# Altium schematic sheet 80PIN_FMU_REV_2A.SchDoc: Cube Yellow and Cube Orange
size A3; Date: 18/08/2014 1:53:28 PM; Author: PR; DrawnBy: Philip Rowse; Engineer: Philip Rowse; Organization: ProfiCNC/Hex; Address3: VIC; Address4: Australia; Revision: A; SheetNumber: 1; SheetTotal: 10
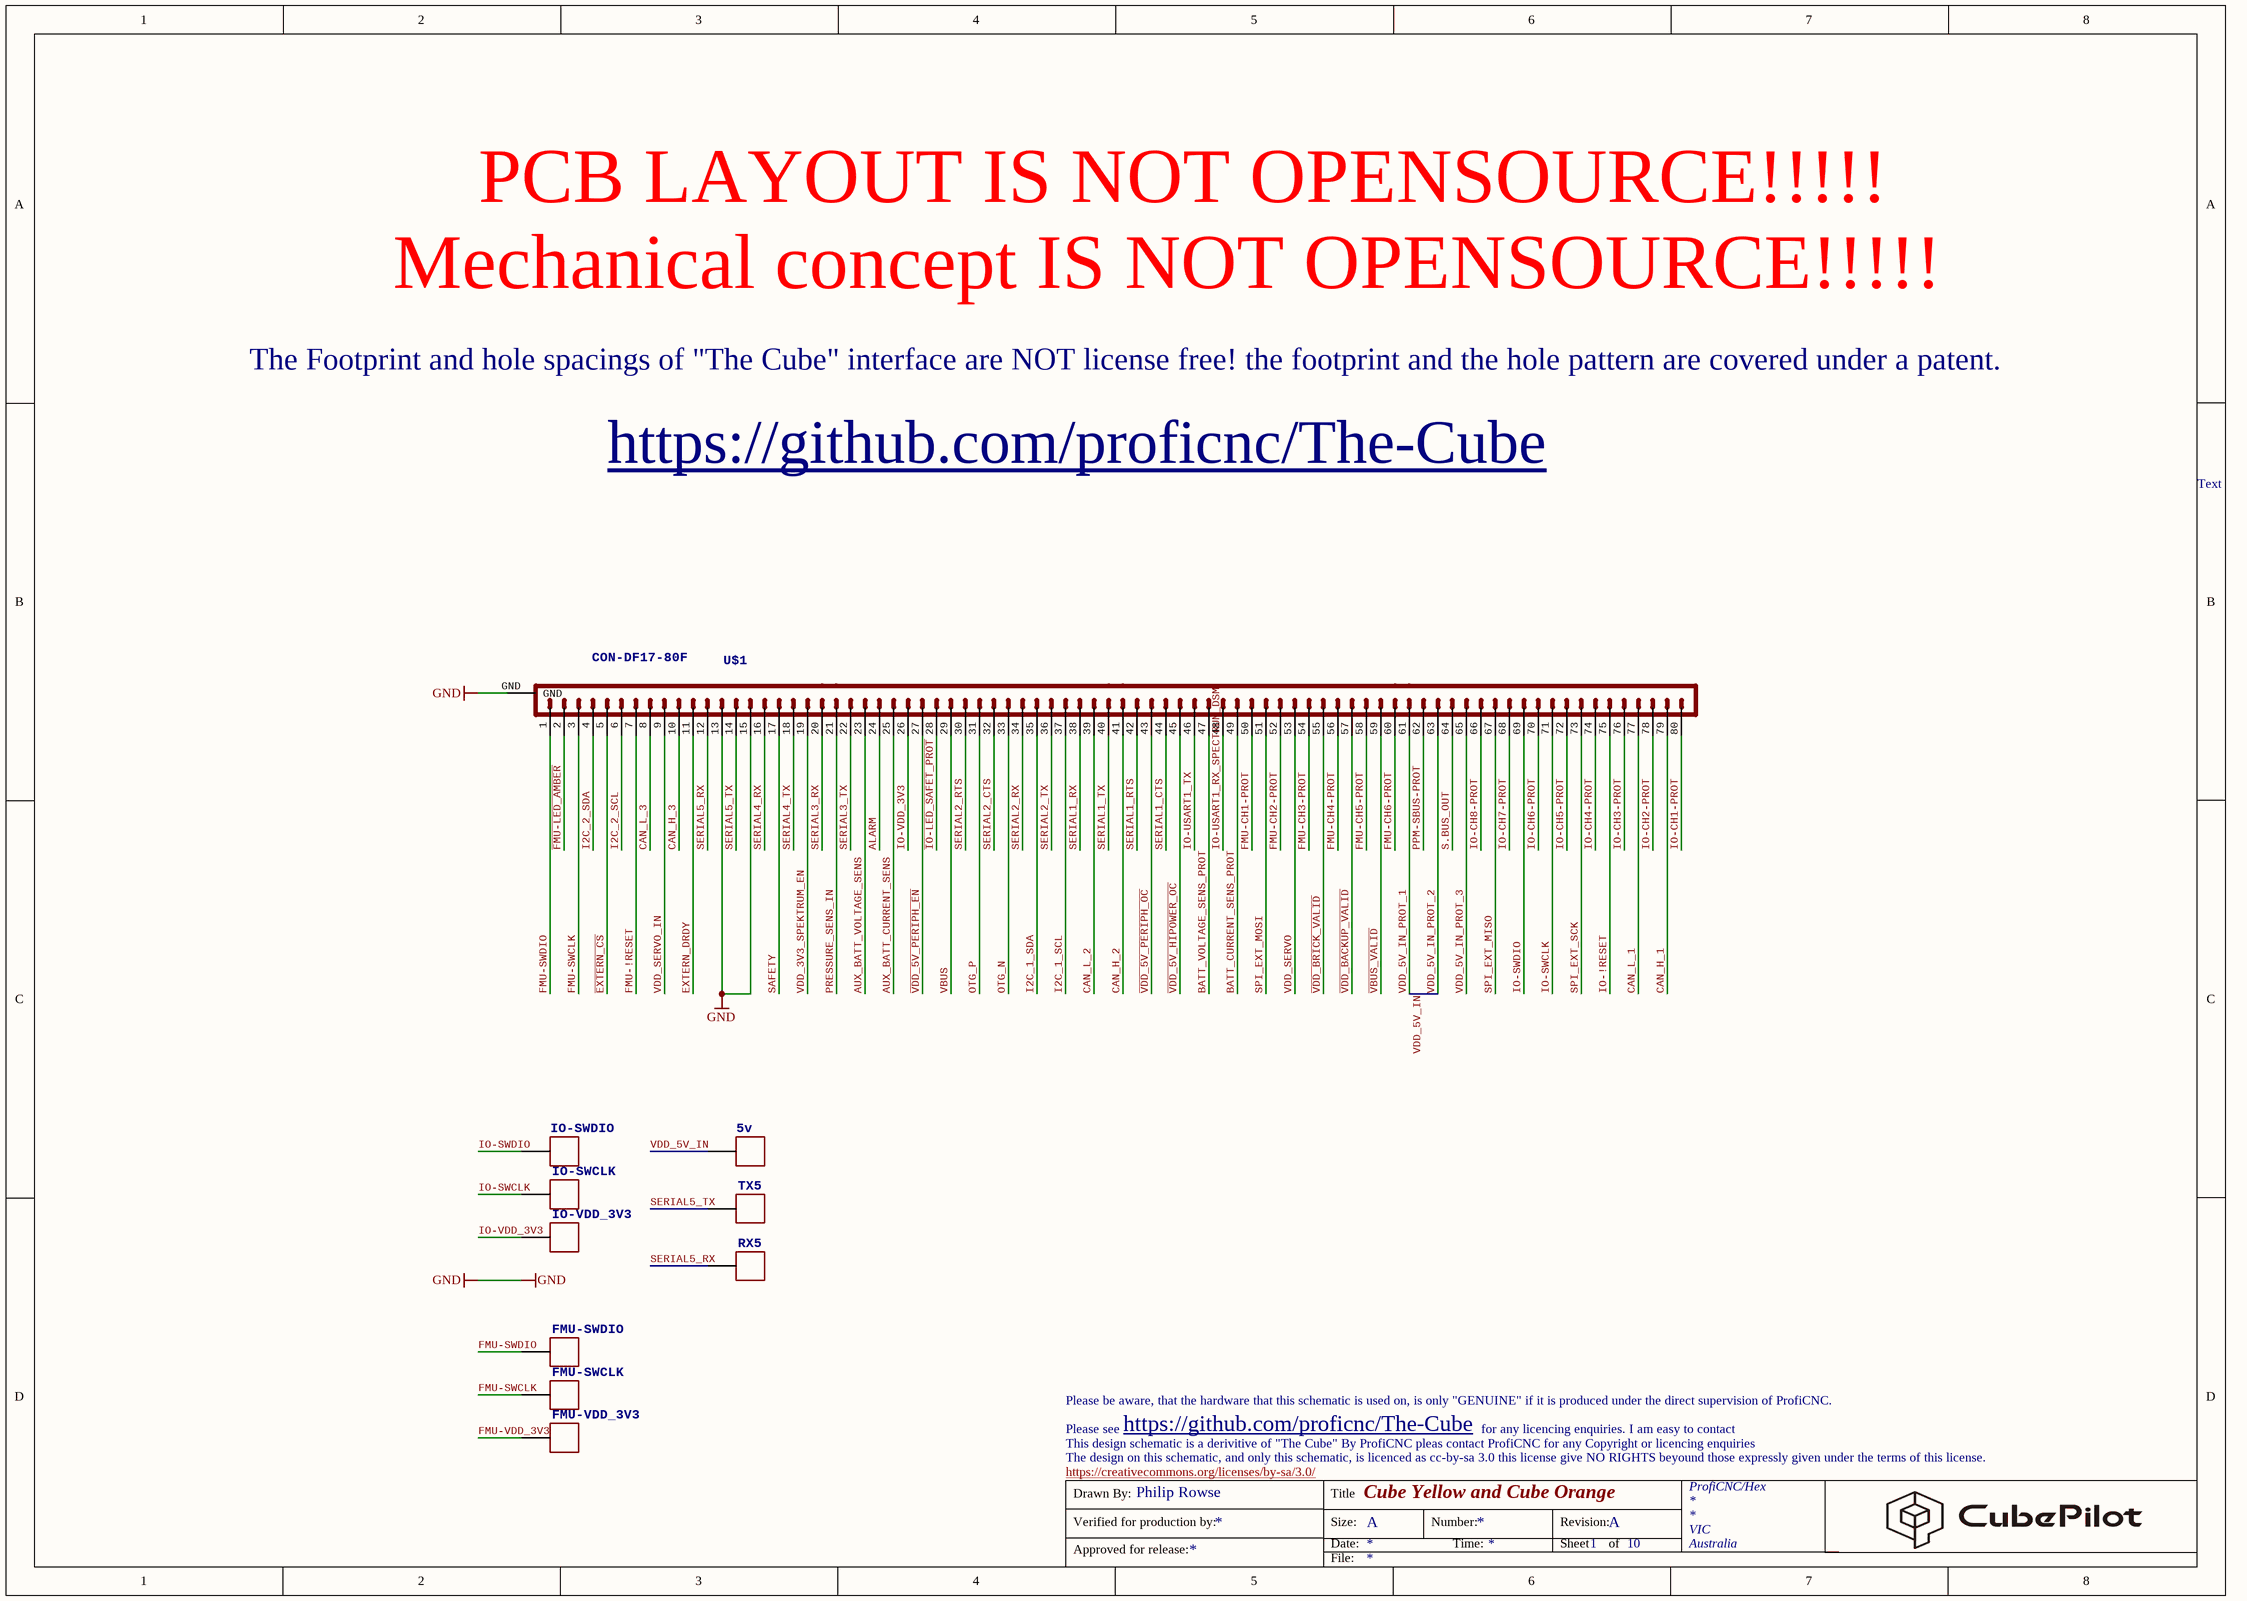
[diagram p0: 80PIN_FMU_REV_2A.SchDoc]

## Parts
5v  PAD.04  [PAD.04X.04]  (value not drawn)
FMU-SWCLK  PAD.04  [PAD.04X.04]  (value not drawn)
FMU-SWDIO  PAD.04  [PAD.04X.04]  (value not drawn)
FMU-VDD_3V3  PAD.04  [PAD.04X.04]  (value not drawn)
IO-SWCLK  PAD.04  [PAD.04X.04]  (value not drawn)
IO-SWDIO  PAD.04  [PAD.04X.04]  (value not drawn)
IO-VDD_3V3  PAD.04  [PAD.04X.04]  (value not drawn)
RX5  PAD.04  [PAD.04X.04]  (value not drawn)
TX5  PAD.04  [PAD.04X.04]  (value not drawn)
U$1  CON-DF17-80F  [CON-DF17-80F]

## Nets
GND: U$1.13 U$1.15 U$1.GND
ALARM: U$1.24
AUX_BATT_CURRENT_SENS: U$1.25
AUX_BATT_VOLTAGE_SENS: U$1.23
BATT_CURRENT_SENS_PROT: U$1.49
BATT_VOLTAGE_SENS_PROT: U$1.47
CAN_H_1: U$1.79
CAN_H_2: U$1.41
CAN_H_3: U$1.10
CAN_L_1: U$1.77
CAN_L_2: U$1.39
CAN_L_3: U$1.8
~{EXTERN_CS}: U$1.5
EXTERN_DRDY: U$1.11
~{FMU-LED_AMBER}: U$1.2
FMU-!RESET: U$1.7
FMU-CH1-PROT: U$1.50
FMU-CH2-PROT: U$1.52
FMU-CH3-PROT: U$1.54
FMU-CH4-PROT: U$1.56
FMU-CH5-PROT: U$1.58
FMU-CH6-PROT: U$1.60
FMU-SWCLK: FMU-SWCLK.P$1 U$1.3
FMU-SWDIO: FMU-SWDIO.P$1 U$1.1
FMU-VDD_3V3: FMU-VDD_3V3.P$1
I2C_1_SCL: U$1.37
I2C_1_SDA: U$1.35
I2C_2_SCL: U$1.6
I2C_2_SDA: U$1.4
~{IO-LED_SAFET_PROT}: U$1.28
IO-!RESET: U$1.75
IO-CH1-PROT: U$1.80
IO-CH2-PROT: U$1.78
IO-CH3-PROT: U$1.76
IO-CH4-PROT: U$1.74
IO-CH5-PROT: U$1.72
IO-CH6-PROT: U$1.70
IO-CH7-PROT: U$1.68
IO-CH8-PROT: U$1.66
IO-SWCLK: IO-SWCLK.P$1 U$1.71
IO-SWDIO: IO-SWDIO.P$1 U$1.69
IO-USART1_RX_SPECTRUM_DSM: U$1.48
IO-USART1_TX: U$1.46
IO-VDD_3V3: IO-VDD_3V3.P$1 U$1.26
OTG_N: U$1.33
OTG_P: U$1.31
PPM-SBUS-PROT: U$1.62
PRESSURE_SENS_IN: U$1.21
S.BUS_OUT: U$1.64
SAFETY: U$1.17
SERIAL1_CTS: U$1.44
SERIAL1_RTS: U$1.42
SERIAL1_RX: U$1.38
SERIAL1_TX: U$1.40
SERIAL2_CTS: U$1.32
SERIAL2_RTS: U$1.30
SERIAL2_RX: U$1.34
SERIAL2_TX: U$1.36
SERIAL3_RX: U$1.20
SERIAL3_TX: U$1.22
SERIAL4_RX: U$1.16
SERIAL4_TX: U$1.18
SERIAL5_RX: RX5.P$1 U$1.12
SERIAL5_TX: TX5.P$1 U$1.14
SPI_EXT_MISO: U$1.67
SPI_EXT_MOSI: U$1.51
SPI_EXT_SCK: U$1.73
~{VBUS_VALID}: U$1.59
~{VDD_5V_HIPOWER_OC}: U$1.45
~{VDD_5V_PERIPH_EN}: U$1.27
~{VDD_5V_PERIPH_OC}: U$1.43
~{VDD_BACKUP_VALID}: U$1.57
~{VDD_BRICK_VALID}: U$1.55
VBUS: U$1.29
VDD_3V3_SPEKTRUM_EN: U$1.19
VDD_5V_IN: 5v.P$1 U$1.61 U$1.63  [also labelled VDD_5V_IN_PROT_1, VDD_5V_IN_PROT_2]
VDD_5V_IN_PROT_3: U$1.65
VDD_SERVO: U$1.53
VDD_SERVO_IN: U$1.9

## Notes on the sheet
- PCB LAYOUT IS NOT OPENSOURCE!!!!!
- Mechanical concept IS NOT OPENSOURCE!!!!!
- The Footprint and hole spacings of "The Cube" interface are NOT license free! the footprint and the hole pattern are covered under a patent.
- https://github.com/proficnc/The-Cube
- Text
- Please be aware, that the hardware that this schematic is used on, is only "GENUINE" if it is produced under the direct supervision of ProfiCNC.
- The design on this schematic, and only this schematic, is licenced as cc-by-sa 3.0 this license give NO RIGHTS beyound those expressly given under the terms of this license.
- This design schematic is a derivitive of "The Cube" By ProfiCNC pleas contact ProfiCNC for any Copyright or licencing enquiries
- https://creativecommons.org/licenses/by-sa/3.0/
- Please see
- for any licencing enquiries. I am easy to contact
- Drawn By:
- Verified for production by:
- Approved for release:
- Title
- Size:
- Date:
- A
- Number:
- Time:
- Revision:
- Sheet
- of
- File:

## Library data of the parts
U$1 = CON-DF17-80F: CONN RECEPT 80POS .5MM SMD W/FIT